# Altium project Telephone.PrjPcb (part 5 of 6)

## Sheet Mechanical.SchDoc: Mechanical
size A4; Organization: ORGANIZATION; Address1: ADDRESS 1; Address2: ADDRESS 2; Address3: ADDRESS 3; Address4: ADDRESS 4; Revision: -; SheetNumber: 11; SheetTotal: 11; ENG_APP_DATE: --/--/--; DSN_APP_DATE: --/--/--; CHK_APP_DATE: --/--/--
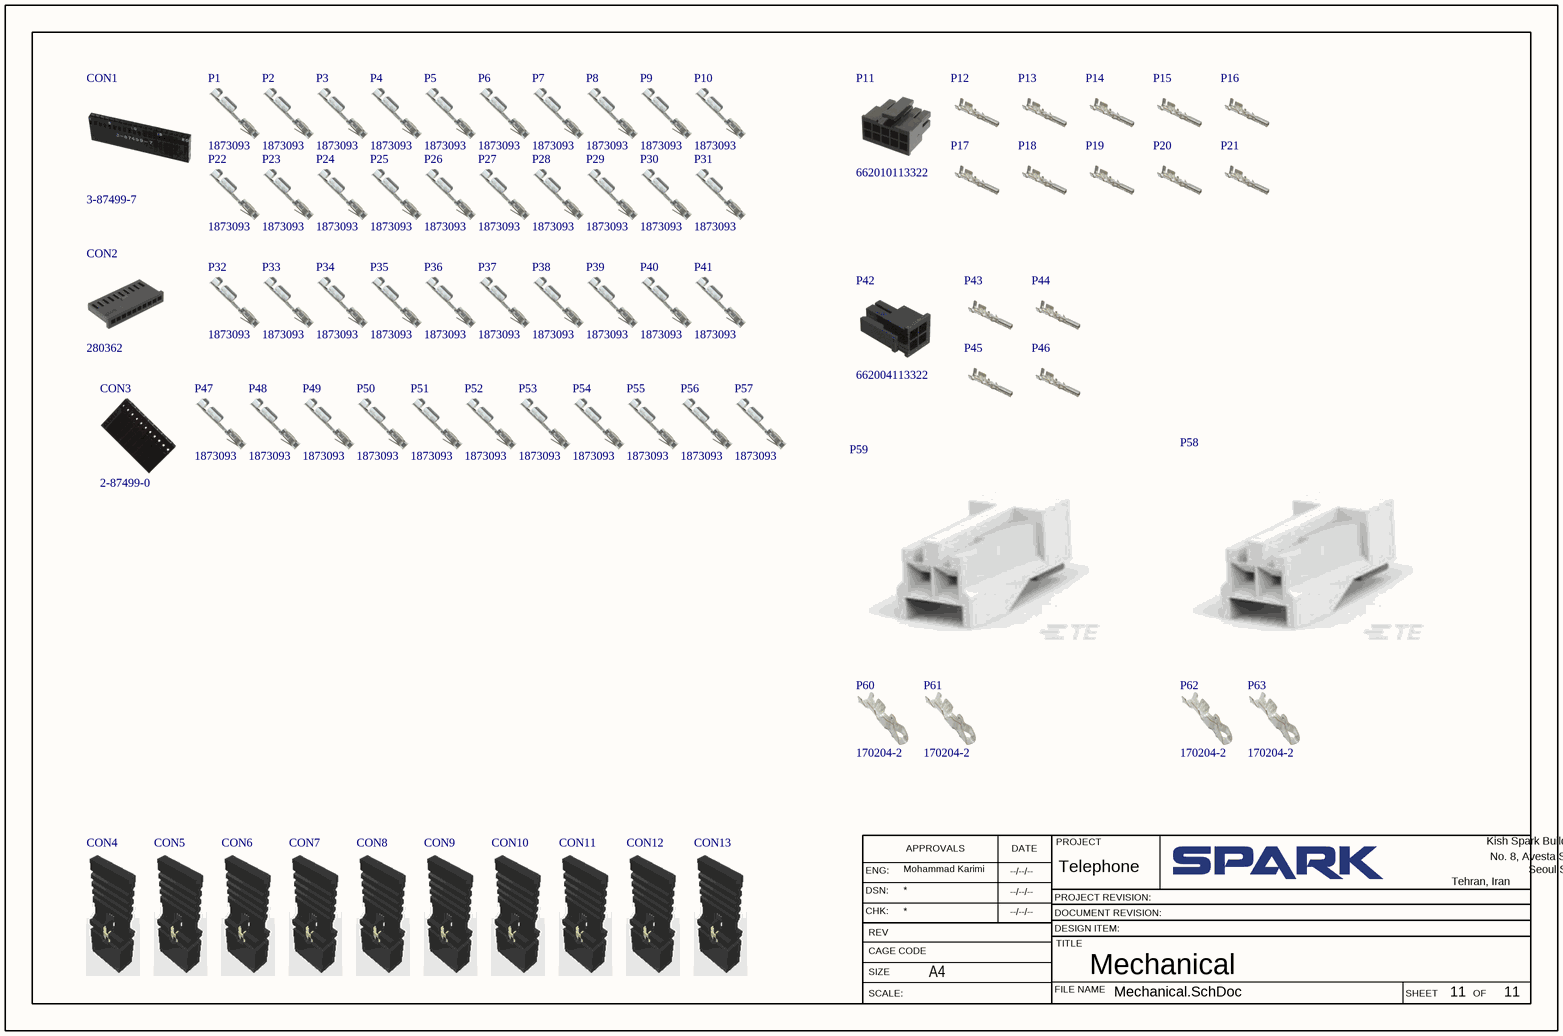
[diagram p9: Mechanical.SchDoc]

### Parts
CON1  3-87499-7  (mechanical)
CON2  280362  (mechanical)
CON3  2-87499-0  (mechanical)
CON4  609002115121  [609002115121-Footprint-1]  (value not drawn)  (mechanical)
CON5  609002115121  [609002115121-Footprint-1]  (value not drawn)  (mechanical)
CON6  609002115121  [609002115121-Footprint-1]  (value not drawn)  (mechanical)
CON7  609002115121  [609002115121-Footprint-1]  (value not drawn)  (mechanical)
CON8  609002115121  [609002115121-Footprint-1]  (value not drawn)  (mechanical)
CON9  609002115121  [609002115121-Footprint-1]  (value not drawn)  (mechanical)
CON10  609002115121  [609002115121-Footprint-1]  (value not drawn)  (mechanical)
CON11  609002115121  [609002115121-Footprint-1]  (value not drawn)  (mechanical)
CON12  609002115121  [609002115121-Footprint-1]  (value not drawn)  (mechanical)
CON13  609002115121  [609002115121-Footprint-1]  (value not drawn)  (mechanical)
P1  1873093  (mechanical)
P2  1873093  (mechanical)
P3  1873093  (mechanical)
P4  1873093  (mechanical)
P5  1873093  (mechanical)
P6  1873093  (mechanical)
P7  1873093  (mechanical)
P8  1873093  (mechanical)
P9  1873093  (mechanical)
P10  1873093  (mechanical)
P11  662010113322  [662010113322-Footprint-1]  (mechanical)
P12  66200113722DEC  (value not drawn)  (mechanical)
P13  66200113722DEC  (value not drawn)  (mechanical)
P14  66200113722DEC  (value not drawn)  (mechanical)
P15  66200113722DEC  (value not drawn)  (mechanical)
P16  66200113722DEC  (value not drawn)  (mechanical)
P17  66200113722DEC  (value not drawn)  (mechanical)
P18  66200113722DEC  (value not drawn)  (mechanical)
P19  66200113722DEC  (value not drawn)  (mechanical)
P20  66200113722DEC  (value not drawn)  (mechanical)
P21  66200113722DEC  (value not drawn)  (mechanical)
P22  1873093  (mechanical)
P23  1873093  (mechanical)
P24  1873093  (mechanical)
P25  1873093  (mechanical)
P26  1873093  (mechanical)
P27  1873093  (mechanical)
P28  1873093  (mechanical)
P29  1873093  (mechanical)
P30  1873093  (mechanical)
P31  1873093  (mechanical)
P32  1873093  (mechanical)
P33  1873093  (mechanical)
P34  1873093  (mechanical)
P35  1873093  (mechanical)
P36  1873093  (mechanical)
P37  1873093  (mechanical)
P38  1873093  (mechanical)
P39  1873093  (mechanical)
P40  1873093  (mechanical)
P41  1873093  (mechanical)
P42  662004113322  [662004113322-Footprint-1]  (mechanical)
P43  66200113722DEC  (value not drawn)  (mechanical)
P44  66200113722DEC  (value not drawn)  (mechanical)
P45  66200113722DEC  (value not drawn)  (mechanical)
P46  66200113722DEC  (value not drawn)  (mechanical)
P47  1873093  (mechanical)
P48  1873093  (mechanical)
P49  1873093  (mechanical)
P50  1873093  (mechanical)
P51  1873093  (mechanical)
P52  1873093  (mechanical)
P53  1873093  (mechanical)
P54  1873093  (mechanical)
P55  1873093  (mechanical)
P56  1873093  (mechanical)
P57  1873093  (mechanical)
P58  CMP-002-00163-4  (value not drawn)  (mechanical)
P59  CMP-002-00163-4  (value not drawn)  (mechanical)
P60  170204-2  (mechanical)
P61  170204-2  (mechanical)
P62  170204-2  (mechanical)
P63  170204-2  (mechanical)

### Notes on the sheet
- APPROVALS
- DATE
- PROJECT
- Kish Spark Building
- No. 8, Avesta Street
- ENG:
- DSN:
- CHK:
- PROJECT REVISION:
- DESIGN ITEM:
- DOCUMENT REVISION:
- Tehran, Iran
- Seoul Street, Sheikh Bahaie
- SIZE
- REV
- SCALE:
- CAGE CODE
- A4
- FILE NAME
- TITLE
- SHEET
- OF

### Library data of the parts
CON1 = CMP-00028-00014-2: Housing, Crimp / Snap, Single Row, 20 250 VAC, 3 A 750 V, AMPMODU Mod IV Series; Approvals: CSA; Connector Type: Receptacle,Socket; Contact Current Rating: 3A; Gender: Receptacle; Insulation Resistance: 5GR; Mating Alignment: No (Without); Max Voltage Rating (AC): 250V; Number of Contacts: 20; Pitch: 2.54mm; Row Spacing: 0.1inch; Max Operating Temperature: 105°C; Min Operating Temperature: -65°C; Mounting Technology: Free Hanging,Cable; Pins: 20; Color: Black; Contact Material: Copper; Contact Type: Male or Female; Current Rating: 3A; Depth: 15.24mm; ELV: Compliant; Flammability Rating: UL94 V-0; Height: 0.14inch; Housing Color: Black; Housing Material: Thermoplastic; Lead Free: Lead Free; Length: 2.01inch; Mating Connector Lock: No (Without); Number of Positions: 20; Number of Rows: 1; Orientation: Straight; Package Quantity: 200; Packaging: Bag; Reach SVHC Compliant: Unknown; Series: AMPMODU MOD IV; Strain Relief: No (Without); Termination: Crimp; Voltage Rating (AC): 250V; Width: 15.24mm
CON2 = CMP-00028-00015-2: Headers & Wire Housings 10 POS RECPT; Manufacturer: TE Connectivity; Pins: 10; Manufacturer Part Number: 280362
CON3 = CMP-00028-00016-2: Conn Housing RCP 11 POS 2.54mm Crimp ST Cable Mount Package; Approvals: CSA; Connector Type: Receptacle,Socket; Contact Current Rating: 3A; Insulation Resistance: 5GR; Mating Alignment: No (Without); Max Voltage Rating (AC): 250V; Number of Contacts: 11; Row Spacing: 0.1inch; Max Operating Temperature: 105°C; Min Operating Temperature: -65°C; Mounting Technology: Free Hanging; Color: Black; Contact Gender: Female; Contact Material: Copper; Contact Type: Female Socket; Current Rating: 3A; Depth: 15.24mm; ELV: Compliant; Flammability Rating: UL94 V-0; Height: 3.56mm; Housing Color: Black; Housing Material: Thermoplastic; Lead Free: Not Applicable; Length: 1.11inch; Mating Connector Lock: No (Without); Number of Positions: 11; Number of Rows: 1; Orientation: Straight; Package Quantity: 1; Packaging: Bulk; Pitch: 2.54mm; Radiation Hardening: No; Series: AMPMODU MOD IV; Strain Relief: No (Without); Termination: Crimp; Voltage Rating (AC): 250V
CON4-CON13 = CMP-00028-00009-4: Insulated WR-PHD Jumper with Testpoint, 3A, 1 x 2, 2.54mm Pitch; Pins: 2
P1-P10 P22-P41 P47-P57 = CMP-00028-00010-3: CONN SOCKET 20-24AWG TIN CRIMP; Approvals: CSA; Contact Current Rating: 3A; Contact Resistance: 12mR; Gender: Female; Insulation Diameter: 1.75mm; Insulation Resistance: 5GR; Shielding: Unshielded; Voltage Rating (AC): 250V; Wire Gauge (Max): 20AWG; Wire Gauge (Min): 24AWG; Wire/Cable Type: Discrete; Max Operating Temperature: 105°C; Min Operating Temperature: -65°C; Mounting Technology: Cable; Connector Type: Socket; Contact Gender: Female; Contact Material: Bronze; Contact Plating: Tin; Contact Type: Signal; Current Rating: 3A; Depth: 2.41mm; ELV: Compliant; Height: 2.03mm; Lead Free: Lead Free; Length: 12.24mm; Orientation: Straight; Package Quantity: 1000; Packaging: Loose Piece; Reach SVHC Compliant: No; Series: AMPMODU Mod V; Termination: Crimp; Wire/Cable Gauge: 24AWG
P11 = CMP-00028-00011-2: WR-MPC3 Series 3mm Pitch 10 Way 2 Row Female Straight PCB Connector Housing 6620; Connector Type: Receptacle; Current Rating: 5A; Insulation: Insulated; Insulation Resistance: 1GR; Number of Contacts: 10; Voltage Rating: 250V; Max Operating Temperature: 105°C; Min Operating Temperature: -25°C; Mounting Technology: Free Hanging; RoHS Compliant: Yes; Color: Black; Contact Gender: Female; Contact Type: Female Socket; Fastening Type: Latch; Flammability Rating: UL94 V-0; Gender: Receptacle; Height: 14mm; Housing Material: Nylon; Length: 15.85mm; Number of Positions: 10; Number of Rows: 2; Packaging: Tray; Pitch: 3mm; Reach SVHC Compliant: Unknown; Series: WR-MPC3; Termination: Crimp; Width: 15.85mm
P12-P21 P43-P46 = CMP-00028-00013-1: WR-MPC3 Series Female Tin Plated CopperAlloy DIN Connector Contact; Contact Design: STAMPED; Current Rating: 5A; Pitch: 3mm; Wire Gauge (Max): 24AWG; Wire Gauge (Min): 20AWG; Pins: 1; Contact Gender: Female; Contact Material: Copper,Tin; Contact Plating: Tin; Height: 2.4mm; Length: 2.6mm; Reach SVHC Compliant: Unknown; Series: WR-MPC3; Termination: Crimp; Width: 15.3mm
P42 = CMP-00028-00012-2: WR-MPC3 Series 3mm Pitch 4 Way 2 Row Female Straight PCB Connector Housing 6620; Connector Type: Receptacle; Current Rating: 5A; Insulation Resistance: 1GR; Number of Contacts: 4; Voltage Rating: 250V; Max Operating Temperature: 105°C; Min Operating Temperature: -25°C; Mounting Technology: Free Hanging; RoHS Compliant: Yes; Color: Black; Contact Type: Female Socket; Fastening Type: Latch; Flammability Rating: UL94 V-0; Gender: Receptacle; Height: 14mm; Housing Material: Nylon; Length: 10.6mm; Number of Positions: 4; Number of Rows: 2; Packaging: Bulk; Pitch: 3mm; Reach SVHC Compliant: Unknown; Row Spacing: 3mm; Series: WR-MPC3; Termination: Crimp; Width: 6.85mm
P58 P59 = CMP-002-00163-4: 2 Position 2.5 mm Crimp Terminal Receptacle Housing Connector; Manufacturer: TE Connectivity; Connector Type: Receptacle,Socket; PCB Mount Retention: Without; Contact Current Rating: 2A; Insulation Resistance: 500MR; Number of Positions: 2; Mating Alignment: Yes (With); Strain Relief: No (Without); Pitch: 2.5mm; Approvals: UL; Manufacturer Part Number: 171822-2; RoHS: Yes; Category: Connectors; Stock 1: 25549; Pricing 1: 1=0.24000, 10=0.16100, 50=0.16100, 100=0.13500, 1000=0.11000, 10000=0.10800 (USD); Mount: Free Hanging,Cable; Housing Color: Natural; Housing Material: Nylon; Color: Natural; Insulation Material: Polyamide; Material: Nylon; Min Operating Temperature: -20°C; Max Operating Temperature: 95°C; Series: EI; Packaging: Bag; Termination: Crimp; Orientation: Straight; Contact Type: Female Socket; Number of Rows: 1; Gender: Receptacle; Contact Gender: Female; Number of Contacts: 2; Mating Retention: Yes (With); Mating Connector Lock: Yes (With); Length: 14mm; Width: 14mm; Height: 5.75mm; Depth: 14mm; RoHS Compliant: Yes; ELV: Compliant; Lead Free: Lead Free; Flammability Rating: UL94 V-0; Reach SVHC Compliant: Yes; ComponentLink1URL: https://datasheet.ciiva.com/5795/1504042-5795504.pdf?src-supplier=Farnell; ComponentLink1Description: https://datasheet.ciiva.com/5795/1504042-5795504.pdf?src-supplier=Farnell; ComponentLink2URL: https://datasheet.ciiva.com/15178/getdatasheetpartid-138116-15178665.pdf?src-supplier=Verical; ComponentLink2Description: https://datasheet.ciiva.com/15178/getdatasheetpartid-138116-15178665.pdf?src-supplier=Verical; ComponentLink3URL: https://datasheet.ciiva.com/16321/tyco20171822-2-16321341.pdf?src-supplier=Future+Electronics; ComponentLink3Description: https://datasheet.ciiva.com/16321/tyco20171822-2-16321341.pdf?src-supplier=Future+Electronics; ComponentLink4URL: https://datasheet.ciiva.com/23813/573455-23813958.pdf?src-supplier=Newark; ComponentLink4Description: https://datasheet.ciiva.com/23813/573455-23813958.pdf?src-supplier=Newark; ComponentLink5URL: https://datasheet.ciiva.com/11740/0900766b80d9a1b1-11740548.pdf?src-supplier=Rs; ComponentLink5Description: https://datasheet.ciiva.com/11740/0900766b80d9a1b1-11740548.pdf?src-supplier=Rs; ComponentLink6URL: https://datasheet.ciiva.com/762/eng-cd-171822-l2-762908.pdf?src-supplier=Digi-Key; ComponentLink6Description: https://datasheet.ciiva.com/762/eng-cd-171822-l2-762908.pdf?src-supplier=Digi-Key; ComponentLink7URL: https://datasheet.ciiva.com/30108/pgurl-0-171822-2-0-30108319.pdf?src-supplier=Onlinecomponents.com; ComponentLink7Description: https://datasheet.ciiva.com/30108/pgurl-0-171822-2-0-30108319.pdf?src-supplier=Onlinecomponents.com; Case/Package: 1000; Pins: 0; Design Item ID: 171822-2; Component Type: Mechanical; Current Rating: 2A; Source: PTZ.SCHLIB
P60-P63 = CMP-002-00176-3: 170204-2 TE Connectivity Connector Contacts SKT Crimp ST Cable Mount 20-26AWG Loose - Arrow.com; Connector Type: Socket; Gender: Female; Insulation Resistance: 500MR; PCB Mount Retention: Without; Contact Current Rating: 2A; Number of Contacts: 6; Shielding: Unshielded; Voltage Rating (AC): 600V; Wire/Cable Gauge: 26AWG; Wire Gauge (Min): 20AWG; Pitch: 2.54mm; Insulation Diameter: 1.91mm; Plating Thickness: 0.8um; Voltage Rating: 250V; Manufacturer: TE Connectivity; Manufacturer Part Number: 170204-2; RoHS: Yes; Category: Connectors; Stock 1: 90196; Pricing 1: 1=0.12, 10=0.088, 50=0.088, 100=0.074, 1000=0.065, 10000=0.065 (USD); Mount: Cable,Through Hole; Contact Material: Bronze; Contact Plating: Tin; Housing Color: White; Housing Material: Nylon; Min Operating Temperature: -20°C; Max Operating Temperature: 105°C; Series: EI; Packaging: Loose Piece; Termination: Crimp; Contact Gender: Female; Orientation: Straight; Contact Type: Signal; Number of Rows: 1; Length: 11.1mm; Height: 10.79mm; Wire Gauge (Max): 26AWG; Depth: 2.36mm; RoHS Compliant: Yes; Reach SVHC Compliant: No; Lead Free: Lead Free; ELV: Compliant; ComponentLink1URL: https://datasheet.ciiva.com/16313/170204-2-16313345.pdf?src-supplier=Future+Electronics; ComponentLink1Description: https://datasheet.ciiva.com/16313/170204-2-16313345.pdf?src-supplier=Future+Electronics; ComponentLink2URL: https://datasheet.ciiva.com/19462/1962957-19462033.pdf?src-supplier=Jameco; ComponentLink2Description: https://datasheet.ciiva.com/19462/1962957-19462033.pdf?src-supplier=Jameco; ComponentLink3URL: https://datasheet.ciiva.com/22685/1688153-22685777.pdf?src-supplier=Element14; ComponentLink3Description: https://datasheet.ciiva.com/22685/1688153-22685777.pdf?src-supplier=Element14; ComponentLink4URL: https://datasheet.ciiva.com/18487/jpn-ss-114-5035-h-18487847.pdf?src-supplier=Digi-Key; ComponentLink4Description: https://datasheet.ciiva.com/18487/jpn-ss-114-5035-h-18487847.pdf?src-supplier=Digi-Key; ComponentLink5URL: https://datasheet.ciiva.com/15175/getdatasheetpartid-32247-15175269.pdf?src-supplier=Verical; ComponentLink5Description: https://datasheet.ciiva.com/15175/getdatasheetpartid-32247-15175269.pdf?src-supplier=Verical; ComponentLink6URL: https://datasheet.ciiva.com/11723/0900766b80d9a1b2-11723424.pdf?src-supplier=Rs; ComponentLink6Description: https://datasheet.ciiva.com/11723/0900766b80d9a1b2-11723424.pdf?src-supplier=Rs; ComponentLink7URL: https://datasheet.ciiva.com/30100/basics0-171822-2-0-30100471.pdf?src-supplier=Onlinecomponents.com; ComponentLink7Description: https://datasheet.ciiva.com/30100/basics0-171822-2-0-30100471.pdf?src-supplier=Onlinecomponents.com; ComponentLink8URL: https://datasheet.ciiva.com/16934/70085978-16934021.pdf?src-supplier=Allied+Electronics; ComponentLink8Description: https://datasheet.ciiva.com/16934/70085978-16934021.pdf?src-supplier=Allied+Electronics; ComponentLink9URL: https://datasheet.ciiva.com/696/jpn-ss-114-5035-h-696652.pdf?src-supplier=Digi-Key; ComponentLink9Description: https://datasheet.ciiva.com/696/jpn-ss-114-5035-h-696652.pdf?src-supplier=Digi-Key; Case/Package: 1000; Pins: 0; Design Item ID: 170204-2; Component Type: Mechanical; Source: V4-TEL.SCHLIB; Mounting Technology: Cable,Through Hole; Max Voltage Rating (AC): 250V; Package Quantity: 1000

## Sheet EEPROM.SchDoc: EEPROM
size A4; Organization: ORGANIZATION; Address1: ADDRESS 1; Address2: ADDRESS 2; Address3: ADDRESS 3; Address4: ADDRESS 4; Revision: -; SheetNumber: 4; SheetTotal: 11; ENG_APP_DATE: --/--/--; DSN_APP_DATE: --/--/--; CHK_APP_DATE: --/--/--
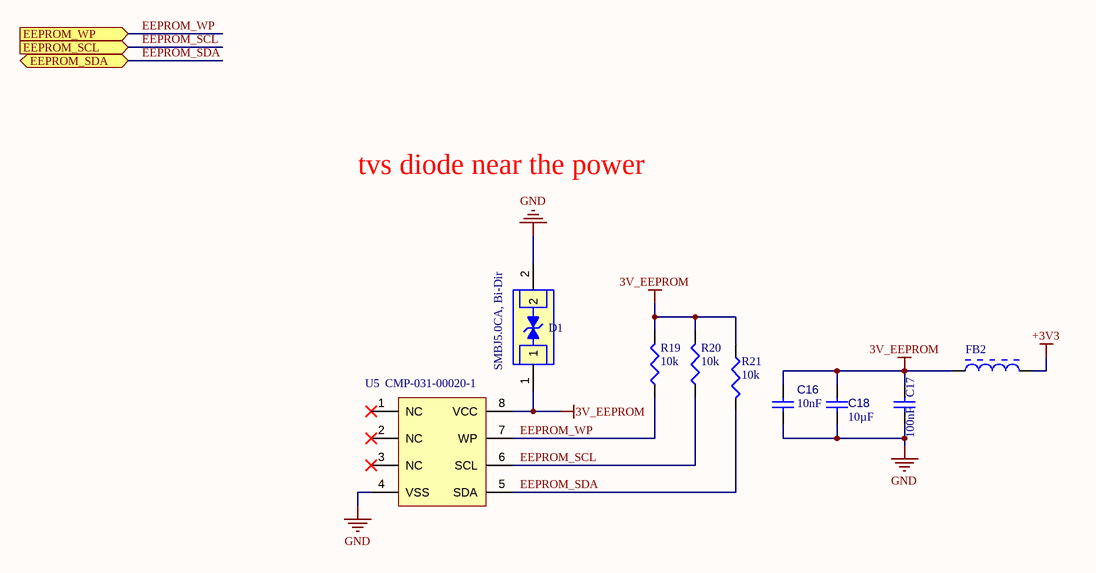
[diagram p10: EEPROM.SchDoc]

### Parts
C16  value 10nF  [C0603]  (hidden comment: 06035C103KAT2A)
C17  value 100nF  [C0603]  (hidden comment: CC0603KRX7R8BB104)
C18  value 10µF  [0805]  (hidden comment: C0805C106K9PACTU)
D1  value SMBJ5.0CA, Bi-Dir  [SMB (DO-214AA)]  (hidden comment: CMP-004-00053-1)
FB2  CMP-006-00051-1  [R0603]  (value not drawn)
R19  value 10k  [R0603]  (hidden comment: CRCW060310K0JNEA)
R20  value 10k  [R0603]  (hidden comment: CRCW060310K0JNEA)
R21  value 10k  [R0603]  (hidden comment: CRCW060310K0JNEA)
U5  CMP-031-00020-1  [NV24C16UV]

### Ports
EEPROM_SCL (in), EEPROM_SDA (bidir), EEPROM_WP (in)

### Nets
3V_EEPROM: C16.2 C17.1 C18.2 D1.1 FB2.1 R19.2 R20.2 R21.1 U5.8(VCC)
+3V3: FB2.2
GND: C16.1 C17.2 C18.1 D1.2 U5.4(VSS)
EEPROM_SCL: R20.1 U5.6(SCL) ; port EEPROM_SCL
EEPROM_SDA: R21.2 U5.5(SDA) ; port EEPROM_SDA
EEPROM_WP: R19.1 U5.7(WP) ; port EEPROM_WP

Not connected (* = marked no-connect by the designer): U5 1(NC)* 2(NC)* 3(NC)*

### Notes on the sheet
- tvs diode near the power
- APPROVALS
- DATE
- PROJECT
- Kish Spark Building
- No. 8, Avesta Street
- ENG:
- DSN:
- CHK:
- PROJECT REVISION:
- DESIGN ITEM:
- DOCUMENT REVISION:
- Tehran, Iran
- Seoul Street, Sheikh Bahaie
- SIZE
- REV
- SCALE:
- CAGE CODE
- A4
- FILE NAME
- TITLE
- SHEET
- OF

### Library data of the parts
C16 = CMP-001-00096-2: 0603 10nF 50 V ±10 % Tolerance X7R Surface Mount Multilayer Ceramic Capacitor; Manufacturer: Kyocera AVX; Voltage Rating: 50V; Tolerance: 10%; Dissipation Factor: 2.5%; Insulation Resistance: 100GR; Case/Package: 0603; Pins: 2; Min Operating Temperature: -55°C; Max Operating Temperature: 125°C; Design Item ID: 06035C103KAT2A; Case Code (Metric): 1608; Category: Ceramic Capacitors; Contact Plating: Tin,Matte; Depth: 0.81mm; Dielectric: X7R; Dielectric Material: Ceramic; Height: 0.9mm; Lead Free: Lead Free; Length: 1.6mm; Manufacturer Part Number: 06035C103KAT2A; Mount: Surface Mount,PCB; Packaging: Tape and Reel; Radiation Hardening: No; REACH SVHC: No SVHC; RoHS: Yes; Stock 1: 4334081; Termination: SMD/SMT; Thickness: 0.035inch; Voltage: 50V; Voltage Rating (DC): 50V; Width: 0.032inch; ComponentLink1Description: https://datasheet.ciiva.com/2987/cx7r-2987824.pdf?src-supplier=Avnet; ComponentLink1URL: https://datasheet.ciiva.com/2987/cx7r-2987824.pdf?src-supplier=Avnet; ComponentLink2Description: https://datasheet.ciiva.com/1124/1679506-1124848.pdf?src-supplier=Element14; ComponentLink2URL: https://datasheet.ciiva.com/1124/1679506-1124848.pdf?src-supplier=Element14; ComponentLink3Description: https://datasheet.ciiva.com/7855/1679506-7855082.pdf?src-supplier=Element14; ComponentLink3URL: https://datasheet.ciiva.com/7855/1679506-7855082.pdf?src-supplier=Element14; ComponentLink4Description: https://datasheet.ciiva.com/150/cx7r-150227.pdf?src-supplier=Digi-Key; ComponentLink4URL: https://datasheet.ciiva.com/150/cx7r-150227.pdf?src-supplier=Digi-Key; ComponentLink5Description: https://datasheet.ciiva.com/150/cx7r-150229.pdf?src-supplier=Digi-Key; ComponentLink5URL: https://datasheet.ciiva.com/150/cx7r-150229.pdf?src-supplier=Digi-Key
C17 = CMP-001-00108-2: YAGEO - CC0603KRX7R8BB104 - CERAMIC CAPACITOR, 0.1UF, 25V, X7R, 10%, 0603, FULL REEL; Case/Package: 0603; Pins: 2; RoHS Compliant: Yes; Min Operating Temperature: -55°C; Max Operating Temperature: 125°C; Voltage Rating: 25V; Tolerance: 10%; Design Item ID: CC0603KRX7R8BB104; Case Code (Metric): 1608; Category: Ceramic Capacitors; Depth: 0.8mm; Dielectric: X7R; Halogen Free: Halogen Free; Height: 0.8mm; Lead Free: Lead Free; Length: 1.6mm; Manufacturer 1: Yageo; Manufacturer Part Number 1: CC0603KRX7R8BB104; Mount: Surface Mount; Package Quantity: 1; Packaging: Tape and Reel; Pricing 1: 1=0.10000, 10=0.05000, 50=0.02720, 100=0.02220, 500=0.01586, 1000=0.01246 (USD); Radiation Hardening: No; REACH SVHC: Unknown; Resistor Type: Ceramic; RoHS: Yes; Series: CC; Source: PTZLib.SchLib; Stock 1: 4053185; Termination: SMD/SMT; Thickness: 0.035inch; Voltage: 25V; Voltage Rating (DC): 25V; Width: 0.8mm; ComponentLink1Description: https://datasheet.ciiva.com/144/mlccorderingcode-144075.pdf?src-supplier=Digi-Key; ComponentLink1URL: https://datasheet.ciiva.com/144/mlccorderingcode-144075.pdf?src-supplier=Digi-Key; ComponentLink2Description: https://datasheet.ciiva.com/11786/0900766b80c10176-11786120.pdf?src-supplier=RSComponents; ComponentLink2URL: https://datasheet.ciiva.com/11786/0900766b80c10176-11786120.pdf?src-supplier=RSComponents; ComponentLink3Description: https://datasheet.ciiva.com/7978/1489800-7978155.pdf?src-supplier=Element14; ComponentLink3URL: https://datasheet.ciiva.com/7978/1489800-7978155.pdf?src-supplier=Element14; ComponentLink4Description: https://datasheet.ciiva.com/28450/1489800-28450584.pdf?src-supplier=Element14; ComponentLink4URL: https://datasheet.ciiva.com/28450/1489800-28450584.pdf?src-supplier=Element14; ComponentLink5Description: https://datasheet.ciiva.com/144/mlccorderingcode-144074.pdf?src-supplier=Digi-Key; ComponentLink5URL: https://datasheet.ciiva.com/144/mlccorderingcode-144074.pdf?src-supplier=Digi-Key; ComponentLink6Description: https://datasheet.ciiva.com/144/mlccorderingcode-144073.pdf?src-supplier=Digi-Key; ComponentLink6URL: https://datasheet.ciiva.com/144/mlccorderingcode-144073.pdf?src-supplier=Digi-Key; ComponentLink7Description: https://datasheet.ciiva.com/13389/upy-gphc-x7r-6-3v-to-50v-8-13389352.pdf?src-supplier=Mouser; ComponentLink7URL: https://datasheet.ciiva.com/13389/upy-gphc-x7r-6-3v-to-50v-8-13389352.pdf?src-supplier=Mouser; ComponentLink8Description: https://datasheet.ciiva.com/11587/upy-gphc-x7r-6-3v-to-50v-8-11587208.pdf?src-supplier=Avnet; ComponentLink8URL: https://datasheet.ciiva.com/11587/upy-gphc-x7r-6-3v-to-50v-8-11587208.pdf?src-supplier=Avnet; ComponentLink9Description: https://datasheet.ciiva.com/26829/getdatasheetpartid-403577-26829431.pdf?src-supplier=Verical; ComponentLink9URL: https://datasheet.ciiva.com/26829/getdatasheetpartid-403577-26829431.pdf?src-supplier=Verical; ComponentLink10Description: https://datasheet.ciiva.com/17434/upy-gphc-x7r-6-3v-to-50v-8-17434263.pdf?src-supplier=Avnet+Europe; ComponentLink10URL: https://datasheet.ciiva.com/17434/upy-gphc-x7r-6-3v-to-50v-8-17434263.pdf?src-supplier=Avnet+Europe
C18 = CMP-001-00180-2: Ceramic Capacitor, 10UF, 6.3V, X5R, 10%, 0805, Full Reel; Manufacturer: KEMET; Dissipation Factor: 5%; Capacitor Type: Ceramic Capacitors; Manufacturer Part Number: C0805C106K9PACTU; Mount: Surface Mount; Case/Package: 0805; Case Code (Metric): 2012; Dielectric Material: Ceramic; Contact Material: Tin; Min Operating Temperature: -55°C; Max Operating Temperature: 85°C; Tolerance: 10%; Voltage Rating (DC): 6.3V; Dielectric: X5R; Packaging: Tape and Reel; Voltage Rating: 6.3V; Series: SMD Comm X5R; Construction: Flat; Length: 2mm; Width: 1.2mm; Height: 1.25mm; Depth: 1.25mm; Lead Pitch: 0.75mm; Radiation Hardening: No; RoHS Compliant: Yes; Lead Free: Lead Free; Reach SVHC Compliant: No; ComponentLink1URL: https://datasheet.ciiva.com/7842/kem-c1006-x5r-smd-7842200.pdf?src-supplier=Element14; ComponentLink1Description: https://datasheet.ciiva.com/7842/kem-c1006-x5r-smd-7842200.pdf?src-supplier=Element14; ComponentLink2URL: https://datasheet.ciiva.com/7842/kem-c1006-x5r-smd-7842201.pdf?src-supplier=Element14; ComponentLink2Description: https://datasheet.ciiva.com/7842/kem-c1006-x5r-smd-7842201.pdf?src-supplier=Element14; ComponentLink3URL: https://datasheet.ciiva.com/7842/40889-7842553.pdf?src-supplier=Element14; ComponentLink3Description: https://datasheet.ciiva.com/7842/40889-7842553.pdf?src-supplier=Element14; ComponentLink4URL: https://datasheet.ciiva.com/7842/40889-7842554.pdf?src-supplier=Element14; ComponentLink4Description: https://datasheet.ciiva.com/7842/40889-7842554.pdf?src-supplier=Element14; ComponentLink5URL: https://datasheet.ciiva.com/18193/getdatasheetpartid-320652-18193500.pdf?src-supplier=Verical; ComponentLink5Description: https://datasheet.ciiva.com/18193/getdatasheetpartid-320652-18193500.pdf?src-supplier=Verical; Pins: 2; Mounting Technology: SMD/SMT
D1 = CMP-004-00053-1: Diode TVS Single Bi-Dir 5V 600W 2-Pin SMBJ; Manufacturer: Bourns; Min Breakdown Voltage: 6.4V; Max Surge Current: 100A; Breakdown Voltage: 7.25V; Polarity: Bidirectional; Peak Pulse Current: 65.2A; Number of Bidirectional Channels: 1; Power Line Protection: No; Diode Type: ZENER; Operating Supply Voltage: 3.5V; Max Reverse Leakage Current: 1.6mA; Test Current: 10mA; Clamping Voltage: 9.2V; Manufacturer Part Number: SMBJ5.0CA; RoHS: Yes; Category: TVS Diodes; Case/Package: DO-214AA; Pins: 2; Min Operating Temperature: -55°C; Max Operating Temperature: 150°C; Packaging: Tape and Reel; Reverse Standoff Voltage: 5V; Peak Pulse Power: 600W; Package Quantity: 1; Termination: SMD/SMT; Max Power Dissipation: 600W; Series: SMBJ; Direction: Bidirectional; Number of Channels: 1; Max Breakdown Voltage: 7.25V; Radiation Hardening: No; RoHS Compliant: Yes; ComponentLink1URL: https://datasheet.ciiva.com/334/smbj-334706.pdf?src-supplier=Digi-Key; ComponentLink1Description: https://datasheet.ciiva.com/334/smbj-334706.pdf?src-supplier=Digi-Key; ComponentLink2URL: https://datasheet.ciiva.com/3022/smbj-3022578.pdf?src-supplier=Avnet; ComponentLink2Description: https://datasheet.ciiva.com/3022/smbj-3022578.pdf?src-supplier=Avnet; ComponentLink3URL: https://datasheet.ciiva.com/334/smbj-334707.pdf?src-supplier=Digi-Key; ComponentLink3Description: https://datasheet.ciiva.com/334/smbj-334707.pdf?src-supplier=Digi-Key; ComponentLink4URL: https://datasheet.ciiva.com/334/smbj-334708.pdf?src-supplier=Digi-Key; ComponentLink4Description: https://datasheet.ciiva.com/334/smbj-334708.pdf?src-supplier=Digi-Key; ComponentLink5URL: https://datasheet.ciiva.com/28410/1677318-28410120.pdf?src-supplier=Element14; ComponentLink5Description: https://datasheet.ciiva.com/28410/1677318-28410120.pdf?src-supplier=Element14; ComponentLink6URL: https://datasheet.ciiva.com/8031/1677318-8031161.pdf?src-supplier=Element14; ComponentLink6Description: https://datasheet.ciiva.com/8031/1677318-8031161.pdf?src-supplier=Element14; ComponentLink7URL: https://datasheet.ciiva.com/30104/smbj-30104446.pdf?src-supplier=Onlinecomponents.com; ComponentLink7Description: https://datasheet.ciiva.com/30104/smbj-30104446.pdf?src-supplier=Onlinecomponents.com; Design Item ID: SMBJ5.0CA; Component Type: Standard; Element Configuration: Single; Leakage Current: 1.6mA; Mount: Surface Mount; Number of Elements: 1; Pin Count: 2; Pricing 1: 1=0.51000, 10=0.38300, 50=0.38300, 100=0.23900, 1000=0.13000, 10000=0.12600 (USD); REACH SVHC: No SVHC; Resistor Type: Zener; Reverse Breakdown Voltage: 6.4V; Source: PTZ.SCHLIB; Stock 1: 248
FB2 = CMP-006-00051-1: Ferrite Beads 0603 60ohm; Manufacturer 1: Murata; Manufacturer Part Number 1: BLM18PG471SN1B; Tolerance: 25%; Impedance: 470R; DC Resistance (DCR): 200mR; Current Rating: 1A; RoHS: Yes; Category: Ferrite Beads and Chips; Case/Package: 0603; Min Operating Temperature: -55°C; Max Operating Temperature: 125°C; Package Quantity: 1000; Packaging: Bulk; ComponentLink1URL: http://www.mouser.com/ds/2/281/c31e-794748.pdf?src-supplier=Mouser; ComponentLink1Description: http://www.mouser.com/ds/2/281/c31e-794748.pdf?src-supplier=Mouser; Pins: 2; Design Item ID: BLM18PG471SN1B; Source: PTZLib.SchLib
R19-R21 = CMP-009-00213-1: Res Thick Film 0603 10K Ohm 5% 1/10W 200ppm/C Molded SMD SMD Paper T/R; Manufacturer 1: Vishay Dale; Voltage Rating: 75V; Max Power Dissipation: 100mW; Temperature Coefficient: 200ppm/°C; Case/Package: 0603; Pins: 2; RoHS Compliant: Yes; Min Operating Temperature: -55°C; Max Operating Temperature: 155°C; Tolerance: 5%; Design Item ID: CRCW060310K0JNEA; Case Code (Metric): 1608; Category: Chip SMD Resistors; Construction: Rectangular; Contact Plating: Tin; Depth: 0.85mm; Features: Automotive AEC-Q200; Height: 0.02inch; Lead Free: Lead Free; Length: 1.55mm; Manufacturer Part Number 1: CRCW060310K0JNEA; Military Standard: Not; Mount: Surface Mount; Number of Terminations: 2; Package Quantity: 1; Packaging: Tape and Reel; Power Rating: 100mW; Pricing 1: 1=0.10000, 10=0.03300, 100=0.01360, 1000=0.00610, 2500=0.00529 (USD); Radiation Hardening: No; REACH SVHC: Unknown; Resistance Tolerance: 5%; Resistor Type: Thick Film; RoHS: Yes; Series: CRCW; Size Code: 0603; Source: PTZLib.SchLib; Stock 1: 41; Termination: SMD/SMT; Voltage Rating (DC): 75V; Weight: 7.1E-05oz; Width: 0.033inch; ComponentLink1Description: https://datasheet.ciiva.com/3256/dcrcwe3-3256943.pdf?src-supplier=Avnet; ComponentLink1URL: https://datasheet.ciiva.com/3256/dcrcwe3-3256943.pdf?src-supplier=Avnet; ComponentLink2Description: https://datasheet.ciiva.com/2461/dcrcwe3-2461971.pdf?src-supplier=Digi-Key; ComponentLink2URL: https://datasheet.ciiva.com/2461/dcrcwe3-2461971.pdf?src-supplier=Digi-Key; ComponentLink3Description: https://datasheet.ciiva.com/2461/dcrcwe3-2461972.pdf?src-supplier=Digi-Key; ComponentLink3URL: https://datasheet.ciiva.com/2461/dcrcwe3-2461972.pdf?src-supplier=Digi-Key; ComponentLink4Description: https://datasheet.ciiva.com/2461/dcrcwe3-2461973.pdf?src-supplier=Digi-Key; ComponentLink4URL: https://datasheet.ciiva.com/2461/dcrcwe3-2461973.pdf?src-supplier=Digi-Key; ComponentLink5Description: https://datasheet.ciiva.com/3256/dcrcwe3-3256942.pdf?src-supplier=Avnet; ComponentLink5URL: https://datasheet.ciiva.com/3256/dcrcwe3-3256942.pdf?src-supplier=Avnet; ComponentLink6Description: https://datasheet.ciiva.com/16343/dcrcwe3-16343525.pdf?src-supplier=Future+Electronics; ComponentLink6URL: https://datasheet.ciiva.com/16343/dcrcwe3-16343525.pdf?src-supplier=Future+Electronics; ComponentLink7Description: https://datasheet.ciiva.com/16755/70201119-16755717.pdf?src-supplier=Allied+Electronics; ComponentLink7URL: https://datasheet.ciiva.com/16755/70201119-16755717.pdf?src-supplier=Allied+Electronics; ComponentLink8Description: https://datasheet.ciiva.com/16515/dcrcwe3-16515020.pdf?src-supplier=Avnet+Asia; ComponentLink8URL: https://datasheet.ciiva.com/16515/dcrcwe3-16515020.pdf?src-supplier=Avnet+Asia; ComponentLink9Description: https://datasheet.ciiva.com/16771/70201119-16771051.pdf?src-supplier=Allied+Electronics; ComponentLink9URL: https://datasheet.ciiva.com/16771/70201119-16771051.pdf?src-supplier=Allied+Electronics
U5 = CMP-031-00020-1: EEPROM Serial 16-Kb I2C - Automotive Grade; Manufacturer: ON Semiconductor; Manufacturer Part Number: NV24C16MUW3VLTBG; RoHS: No; Category: EEPROM; Pricing 1: 1=0.39, 10=0.374, 50=0.374, 100=0.307, 1000=0.291, 10000=0.276 (USD); Design Item ID: NV24C16MUW3VLTBG; Component Type: Standard; Pin Count: 8; Source: V4-TEL.SCHLIB

## Sheet CallerID.SchDoc: Caller ID
size A4; Organization: ORGANIZATION; Address1: ADDRESS 1; Address2: ADDRESS 2; Address3: ADDRESS 3; Address4: ADDRESS 4; Revision: -; SheetNumber: 7; SheetTotal: 11; ENG_APP_DATE: --/--/--; DSN_APP_DATE: --/--/--; CHK_APP_DATE: --/--/--
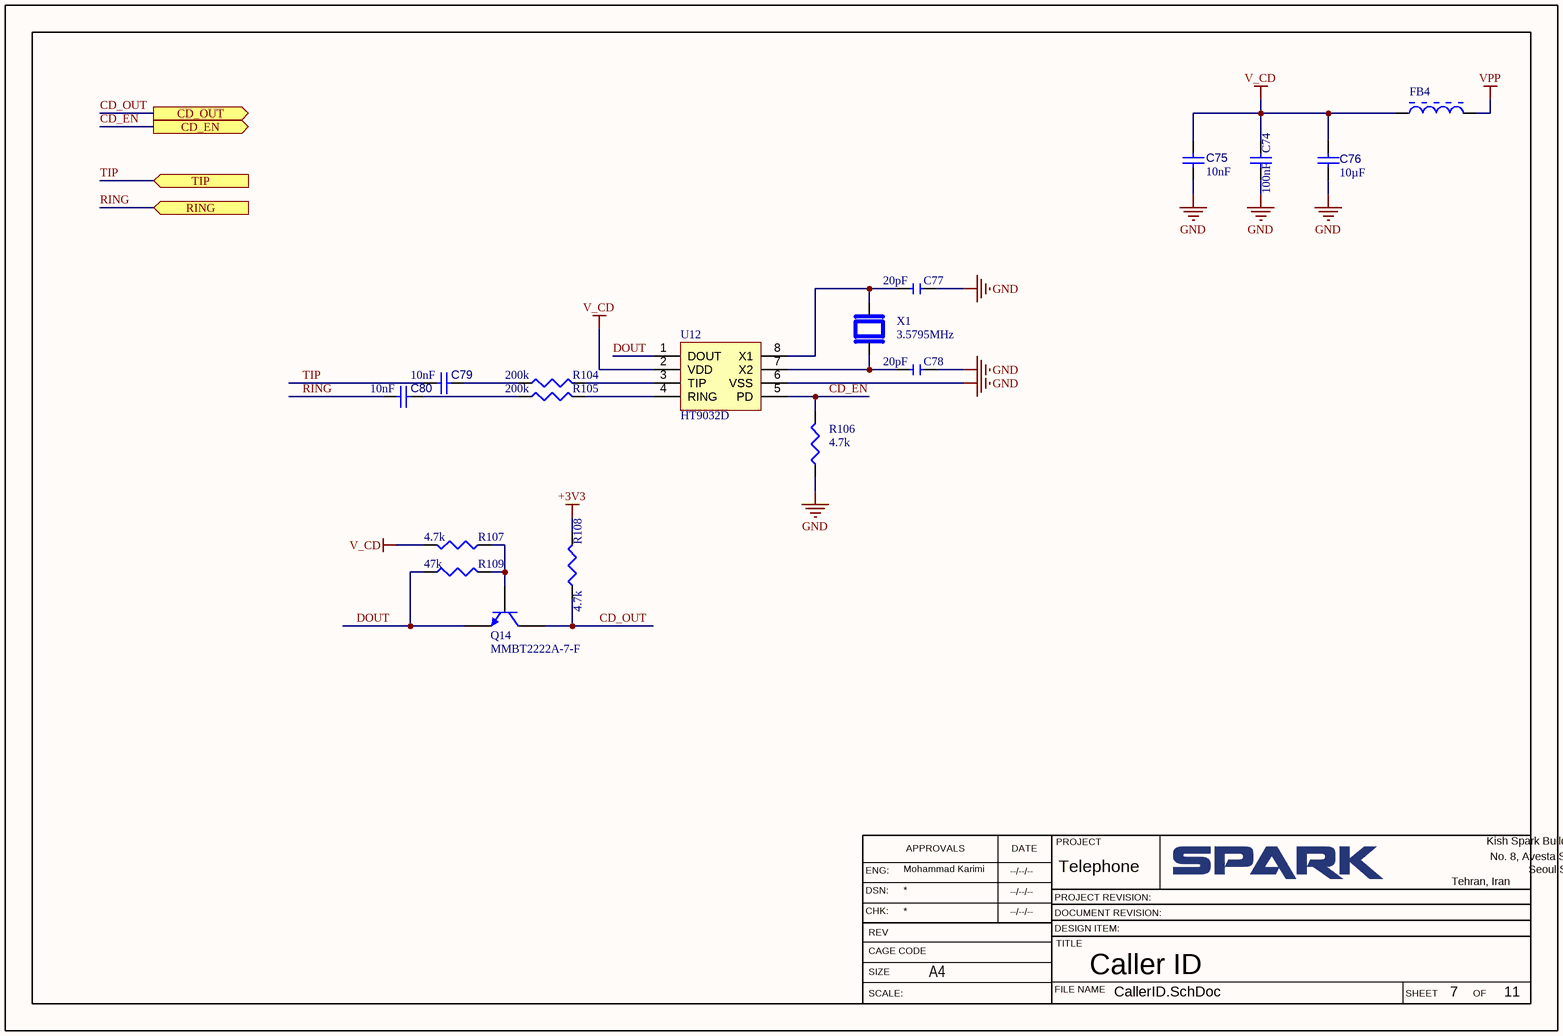
[diagram p11: CallerID.SchDoc]

### Parts
C74  value 100nF  [C0603]  (hidden comment: CC0603KRX7R8BB104)
C75  value 10nF  [C0603]  (hidden comment: 06035C103KAT2A)
C76  value 10µF  [0805]  (hidden comment: C0805C106K9PACTU)
C77  value 20pF  [0805]  (hidden comment: CMP-001-00183-1)
C78  value 20pF  [0805]  (hidden comment: CMP-001-00183-1)
C79  value 10nF  [C0603]  (hidden comment: 06035C103KAT2A)
C80  value 10nF  [C0603]  (hidden comment: 06035C103KAT2A)
FB4  CMP-006-00051-1  [R0603]  (value not drawn)
Q14  MMBT2222A-7-F  [SOT23127P600-8N]
R104  value 200k  [0805]  (hidden comment: CMP-009-00307-1)
R105  value 200k  [0805]  (hidden comment: CMP-009-00307-1)
R106  value 4.7k  [R0603]  (hidden comment: KTR03EZPJ472)
R107  value 4.7k  [R0603]  (hidden comment: KTR03EZPJ472)
R108  value 4.7k  [R0603]  (hidden comment: KTR03EZPJ472)
R109  value 47k  [0805]  (hidden comment: CMP-009-00314-1)
U12  HT9032D  [SSOIC8]
X1  Frequency: 3.5795MHz  [XTAL]  (hidden comment: CMP-003-00038-1)

### Ports
CD_EN (out), CD_OUT (out), RING (in), TIP (in)

### Nets
+3V3: R108.2
GND: C74.2 C75.2 C76.1 C77.1 C78.1 R106.1 U12.6(VSS)
V_CD: C74.1 C75.1 C76.2 FB4.1 R107.2 U12.2(VDD)
VPP: FB4.2
CD_EN: R106.2 U12.5(PD) ; port CD_EN
CD_OUT: Q14.3(C) R108.1 ; port CD_OUT
DOUT: Q14.1(E) R109.1 U12.1(DOUT)
RING: C80.2 ; port RING
TIP: C79.2 ; port TIP
NetC77_2: C77.2 U12.8(X1) X1.1
NetC78_2: C78.2 U12.7(X2) X1.2
NetC79_1: C79.1 R104.1
NetC80_1: C80.1 R105.1
NetQ14_2: Q14.2(B) R107.1 R109.2
NetR104_2: R104.2 U12.3(TIP)
NetR105_2: R105.2 U12.4(RING)

### Notes on the sheet
- APPROVALS
- DATE
- PROJECT
- Kish Spark Building
- No. 8, Avesta Street
- ENG:
- DSN:
- CHK:
- PROJECT REVISION:
- DESIGN ITEM:
- DOCUMENT REVISION:
- Tehran, Iran
- Seoul Street, Sheikh Bahaie
- SIZE
- REV
- SCALE:
- CAGE CODE
- A4
- FILE NAME
- TITLE
- SHEET
- OF

### Library data of the parts
C74 = CMP-001-00108-2: as C17 on sheet EEPROM; Case/Package: 0603; Pins: 2; RoHS Compliant: Yes; Min Operating Temperature: -55°C; Max Operating Temperature: 125°C; Voltage Rating: 25V; Tolerance: 10%; Design Item ID: CC0603KRX7R8BB104; Case Code (Metric): 1608; Category: Ceramic Capacitors; Depth: 0.8mm; Dielectric: X7R; Halogen Free: Halogen Free; Height: 0.8mm; Lead Free: Lead Free; Length: 1.6mm; Manufacturer 1: Yageo; Manufacturer Part Number 1: CC0603KRX7R8BB104; Mount: Surface Mount; Package Quantity: 1; Packaging: Tape and Reel; Pricing 1: 1=0.10000, 10=0.05000, 50=0.02720, 100=0.02220, 500=0.01586, 1000=0.01246 (USD); Radiation Hardening: No; REACH SVHC: Unknown; Resistor Type: Ceramic; RoHS: Yes; Series: CC; Source: PTZLib.SchLib; Stock 1: 4053185; Termination: SMD/SMT; Thickness: 0.035inch; Voltage: 25V; Voltage Rating (DC): 25V; Width: 0.8mm; ComponentLink1Description: https://datasheet.ciiva.com/144/mlccorderingcode-144075.pdf?src-supplier=Digi-Key; ComponentLink1URL: https://datasheet.ciiva.com/144/mlccorderingcode-144075.pdf?src-supplier=Digi-Key; ComponentLink2Description: https://datasheet.ciiva.com/11786/0900766b80c10176-11786120.pdf?src-supplier=RSComponents; ComponentLink2URL: https://datasheet.ciiva.com/11786/0900766b80c10176-11786120.pdf?src-supplier=RSComponents; ComponentLink3Description: https://datasheet.ciiva.com/7978/1489800-7978155.pdf?src-supplier=Element14; ComponentLink3URL: https://datasheet.ciiva.com/7978/1489800-7978155.pdf?src-supplier=Element14; ComponentLink4Description: https://datasheet.ciiva.com/28450/1489800-28450584.pdf?src-supplier=Element14; ComponentLink4URL: https://datasheet.ciiva.com/28450/1489800-28450584.pdf?src-supplier=Element14; ComponentLink5Description: https://datasheet.ciiva.com/144/mlccorderingcode-144074.pdf?src-supplier=Digi-Key; ComponentLink5URL: https://datasheet.ciiva.com/144/mlccorderingcode-144074.pdf?src-supplier=Digi-Key; ComponentLink6Description: https://datasheet.ciiva.com/144/mlccorderingcode-144073.pdf?src-supplier=Digi-Key; ComponentLink6URL: https://datasheet.ciiva.com/144/mlccorderingcode-144073.pdf?src-supplier=Digi-Key; ComponentLink7Description: https://datasheet.ciiva.com/13389/upy-gphc-x7r-6-3v-to-50v-8-13389352.pdf?src-supplier=Mouser; ComponentLink7URL: https://datasheet.ciiva.com/13389/upy-gphc-x7r-6-3v-to-50v-8-13389352.pdf?src-supplier=Mouser; ComponentLink8Description: https://datasheet.ciiva.com/11587/upy-gphc-x7r-6-3v-to-50v-8-11587208.pdf?src-supplier=Avnet; ComponentLink8URL: https://datasheet.ciiva.com/11587/upy-gphc-x7r-6-3v-to-50v-8-11587208.pdf?src-supplier=Avnet; ComponentLink9Description: https://datasheet.ciiva.com/26829/getdatasheetpartid-403577-26829431.pdf?src-supplier=Verical; ComponentLink9URL: https://datasheet.ciiva.com/26829/getdatasheetpartid-403577-26829431.pdf?src-supplier=Verical; ComponentLink10Description: https://datasheet.ciiva.com/17434/upy-gphc-x7r-6-3v-to-50v-8-17434263.pdf?src-supplier=Avnet+Europe; ComponentLink10URL: https://datasheet.ciiva.com/17434/upy-gphc-x7r-6-3v-to-50v-8-17434263.pdf?src-supplier=Avnet+Europe
C75 C79 C80 = CMP-001-00096-2: as C16 on sheet EEPROM; Case/Package: 0603; Pins: 2; Min Operating Temperature: -55°C; Max Operating Temperature: 125°C; Design Item ID: 06035C103KAT2A; Case Code (Metric): 1608; Category: Ceramic Capacitors; Contact Plating: Tin,Matte; Depth: 0.81mm; Dielectric: X7R; Dielectric Material: Ceramic; Height: 0.9mm; Lead Free: Lead Free; Length: 1.6mm; Manufacturer Part Number: 06035C103KAT2A; Mount: Surface Mount,PCB; Packaging: Tape and Reel; Radiation Hardening: No; REACH SVHC: No SVHC; RoHS: Yes; Stock 1: 4334081; Termination: SMD/SMT; Thickness: 0.035inch; Voltage: 50V; Voltage Rating (DC): 50V; Width: 0.032inch; ComponentLink1Description: https://datasheet.ciiva.com/2987/cx7r-2987824.pdf?src-supplier=Avnet; ComponentLink1URL: https://datasheet.ciiva.com/2987/cx7r-2987824.pdf?src-supplier=Avnet; ComponentLink2Description: https://datasheet.ciiva.com/1124/1679506-1124848.pdf?src-supplier=Element14; ComponentLink2URL: https://datasheet.ciiva.com/1124/1679506-1124848.pdf?src-supplier=Element14; ComponentLink3Description: https://datasheet.ciiva.com/7855/1679506-7855082.pdf?src-supplier=Element14; ComponentLink3URL: https://datasheet.ciiva.com/7855/1679506-7855082.pdf?src-supplier=Element14; ComponentLink4Description: https://datasheet.ciiva.com/150/cx7r-150227.pdf?src-supplier=Digi-Key; ComponentLink4URL: https://datasheet.ciiva.com/150/cx7r-150227.pdf?src-supplier=Digi-Key; ComponentLink5Description: https://datasheet.ciiva.com/150/cx7r-150229.pdf?src-supplier=Digi-Key; ComponentLink5URL: https://datasheet.ciiva.com/150/cx7r-150229.pdf?src-supplier=Digi-Key
C76 = CMP-001-00180-2: as C18 on sheet EEPROM; Manufacturer Part Number: C0805C106K9PACTU; Mount: Surface Mount; Case/Package: 0805; Case Code (Metric): 2012; Dielectric Material: Ceramic; Contact Material: Tin; Min Operating Temperature: -55°C; Max Operating Temperature: 85°C; Tolerance: 10%; Voltage Rating (DC): 6.3V; Dielectric: X5R; Packaging: Tape and Reel; Voltage Rating: 6.3V; Series: SMD Comm X5R; Construction: Flat; Length: 2mm; Width: 1.2mm; Height: 1.25mm; Depth: 1.25mm; Lead Pitch: 0.75mm; Radiation Hardening: No; RoHS Compliant: Yes; Lead Free: Lead Free; Reach SVHC Compliant: No; ComponentLink1URL: https://datasheet.ciiva.com/7842/kem-c1006-x5r-smd-7842200.pdf?src-supplier=Element14; ComponentLink1Description: https://datasheet.ciiva.com/7842/kem-c1006-x5r-smd-7842200.pdf?src-supplier=Element14; ComponentLink2URL: https://datasheet.ciiva.com/7842/kem-c1006-x5r-smd-7842201.pdf?src-supplier=Element14; ComponentLink2Description: https://datasheet.ciiva.com/7842/kem-c1006-x5r-smd-7842201.pdf?src-supplier=Element14; ComponentLink3URL: https://datasheet.ciiva.com/7842/40889-7842553.pdf?src-supplier=Element14; ComponentLink3Description: https://datasheet.ciiva.com/7842/40889-7842553.pdf?src-supplier=Element14; ComponentLink4URL: https://datasheet.ciiva.com/7842/40889-7842554.pdf?src-supplier=Element14; ComponentLink4Description: https://datasheet.ciiva.com/7842/40889-7842554.pdf?src-supplier=Element14; ComponentLink5URL: https://datasheet.ciiva.com/18193/getdatasheetpartid-320652-18193500.pdf?src-supplier=Verical; ComponentLink5Description: https://datasheet.ciiva.com/18193/getdatasheetpartid-320652-18193500.pdf?src-supplier=Verical; Pins: 2; Mounting Technology: SMD/SMT
C77 C78 = CMP-001-00183-1: CAP CER 20PF 50V NPO 0805; Manufacturer: Yageo; Tolerance: 5%; Dielectric: NP0; Manufacturer Part Number: CC0805JRNPO9BN200; RoHS: Yes; Category: Ceramic Capacitors; Stock: 3029; Pricing: 1=0.13, 10=0.054, 50=0.054, 100=0.032, 1000=0.026, 10000=0.017 (USD); Mounting Technology: Surface Mount; Case/Package: 0805; Pins: 2; Case Code (Metric): 2012; Min Operating Temperature: -55°C; Max Operating Temperature: 125°C; Voltage Rating: 50V; Packaging: Tape and Reel; Voltage Rating (DC): 50V; Termination: SMD/SMT; Series: CC; Length: 0.079inch; Width: 1.25mm; Thickness: 0.028inch; Lead Free: Lead Free; ComponentLink1URL: https://datasheet.ciiva.com/5427/upy-gp-np0-16v-to-50v-8-5427416.pdf?src-supplier=Mouser; ComponentLink1Description: https://datasheet.ciiva.com/5427/upy-gp-np0-16v-to-50v-8-5427416.pdf?src-supplier=Mouser; Design Item ID: CC0805JRNPO9BN200; Component Type: Standard; Pin Count: 2; Source: V4-TEL.SCHLIB
FB4 = CMP-006-00051-1: as FB2 on sheet EEPROM; RoHS: Yes; Category: Ferrite Beads and Chips; Case/Package: 0603; Min Operating Temperature: -55°C; Max Operating Temperature: 125°C; Package Quantity: 1000; Packaging: Bulk; ComponentLink1URL: http://www.mouser.com/ds/2/281/c31e-794748.pdf?src-supplier=Mouser; ComponentLink1Description: http://www.mouser.com/ds/2/281/c31e-794748.pdf?src-supplier=Mouser; Pins: 2; Design Item ID: BLM18PG471SN1B; Source: PTZLib.SchLib
Q14 = CMP-012-00003-2: MMBT2222 Series NPN 350 mW 40 V 600 mA SMT Small Signal Transistor - SOT-23; Manufacturer: Diodes; Current Rating: 600mA; Voltage Rating: 40V; Collector Base Voltage (VCBO): 75V; Collector Emitter Saturation Voltage: 1V; Current: 1A; Element Configuration: Single; Emitter Base Voltage (VEBO): 6V; Frequency: 300MHz; hFE Min: 100; Max Power Dissipation: 300mW; Number of Elements: 1; Power Dissipation: 350mW; Case/Package: SOT-23-3; Pins: 3; RoHS Compliant: Yes; Min Operating Temperature: -55°C; Max Operating Temperature: 150°C; Design Item ID: MMBT2222A-7-F; Category: BJTs; Collector Emitter Breakdown Voltage: 40V; Collector Emitter Voltage (VCEO): 40V; Collector-emitter Voltage-Max: 1V; Component Type: Standard; Contact Plating: Tin,Matte; Continuous Collector Current: 600mA; Gain Bandwidth Product: 300MHz; Height: 1mm; Lead Free: Lead Free; Length: 3.05mm; Manufacturer Part Number: MMBT2222A-7-F; Max Collector Current: 600mA; Max Frequency: 300MHz; Mount: Surface Mount; Package Quantity: 3000; Packaging: Tape and Reel; Pin Count: 3; Polarity: NPN; Pricing 1: 1=0.14000, 10=0.13300, 50=0.13300, 100=0.07200, 500=0.04500, 1000=0.03100, 3000=0.02300, 9000=0.02000, 10000=0.02000, 24000=0.01800, 45000=0.01500 (USD); Radiation Hardening: No; Reach SVHC Compliant: Yes; RoHS: Yes; Series: Automotive, AEC-Q101; Source: PTZ.SCHLIB; Stock 1: 1743698; Termination: SMD/SMT; Transition Frequency: 300MHz; Voltage: 40V; Voltage Rating (DC): 40V; Weight: 0.000282oz; Width: 1.4mm; ComponentLink1Description: https://datasheet.ciiva.com/15139/getdatasheetpartid-82692-15139078.pdf?src-supplier=Verical; ComponentLink1URL: https://datasheet.ciiva.com/15139/getdatasheetpartid-82692-15139078.pdf?src-supplier=Verical; ComponentLink2Description: https://datasheet.ciiva.com/8029/ds30041-8029709.pdf?src-supplier=Element14; ComponentLink2URL: https://datasheet.ciiva.com/8029/ds30041-8029709.pdf?src-supplier=Element14; ComponentLink3Description: https://datasheet.ciiva.com/11201/ds30041-11201864.pdf?src-supplier=Avnet; ComponentLink3URL: https://datasheet.ciiva.com/11201/ds30041-11201864.pdf?src-supplier=Avnet; ComponentLink4Description: https://datasheet.ciiva.com/16199/ds30041-16199045.pdf?src-supplier=Future+Electronics; ComponentLink4URL: https://datasheet.ciiva.com/16199/ds30041-16199045.pdf?src-supplier=Future+Electronics; ComponentLink5Description: https://datasheet.ciiva.com/11198/ds30041-11198965.pdf?src-supplier=Avnet; ComponentLink5URL: https://datasheet.ciiva.com/11198/ds30041-11198965.pdf?src-supplier=Avnet; ComponentLink6Description: https://datasheet.ciiva.com/972/ds30041-972551.pdf?src-supplier=Digi-Key; ComponentLink6URL: https://datasheet.ciiva.com/972/ds30041-972551.pdf?src-supplier=Digi-Key; ComponentLink7Description: https://datasheet.ciiva.com/972/ds30041-972552.pdf?src-supplier=Digi-Key; ComponentLink7URL: https://datasheet.ciiva.com/972/ds30041-972552.pdf?src-supplier=Digi-Key; ComponentLink8Description: https://datasheet.ciiva.com/972/ds30041-972550.pdf?src-supplier=Digi-Key; ComponentLink8URL: https://datasheet.ciiva.com/972/ds30041-972550.pdf?src-supplier=Digi-Key
R104 R105 = CMP-009-00307-1: Res Thick Film 0805 200K Ohm 1% 1/8W ±100ppm/°C Molded SMD Paper T/R; Manufacturer: Yageo; Manufacturer Part Number: RC0805FR-07200KL; Power Rating: 125mW; Voltage Rating: 150V; RoHS: Yes; Category: Chip SMD Resistors; Stock 1: 312674; Pricing 1: 1=0.1, 10=0.033, 50=0.033, 100=0.014, 1000=0.006, 10000=0.003 (USD); Case/Package: 0805; Case Code (Metric): 2012; Contact Plating: Tin,Matte; Min Operating Temperature: -55°C; Max Operating Temperature: 155°C; Tolerance: 1%; Packaging: Tape and Reel; Termination: SMD/SMT; Resistor Type: Thick Film; Temperature Coefficient: 100ppm/°C; Voltage Rating (DC): 150V; Working Voltage: 150V; Number of Terminations: 2; Features: Moisture Resistant; Series: RC; Max Power Dissipation: 125mW; Resistance Tolerance: 1%; Technology: THICK FILM; Construction: Rectangular; Length: 2mm; Height: 0.5mm; Depth: 1.25mm; Reach SVHC Compliant: No; Military Standard: Not; Lead Free: Lead Free; RoHS Compliant: Yes; ComponentLink1URL: https://datasheet.ciiva.com/46395/444164-46395126.pdf?src-supplier=Element14; ComponentLink1Description: https://datasheet.ciiva.com/46395/444164-46395126.pdf?src-supplier=Element14; ComponentLink2URL: https://datasheet.ciiva.com/12668/rc0805-12668200.pdf?src-supplier=Mouser; ComponentLink2Description: https://datasheet.ciiva.com/12668/rc0805-12668200.pdf?src-supplier=Mouser; ComponentLink3URL: https://datasheet.ciiva.com/15189/getdatasheetpartid-71710-15189925.pdf?src-supplier=Verical; ComponentLink3Description: https://datasheet.ciiva.com/15189/getdatasheetpartid-71710-15189925.pdf?src-supplier=Verical; Pins: 2; Design Item ID: RC0805FR-07200KL; Component Type: Standard; Pin Count: 2; Source: V4-TEL.SCHLIB
R106-R108 = CMP-009-00190-2: RES SMD 4.7K OHM 5% 1/10W 0603; Manufacturer 1: Rohm; Max Power Dissipation: 100mW; Temperature Coefficient: 200ppm/°C; Case/Package: 0603; RoHS Compliant: Yes; Min Operating Temperature: -55°C; Max Operating Temperature: 155°C; Tolerance: 5%; Design Item ID: KTR03EZPJ472; Category: Chip SMD Resistors; Height: 0.022inch; Length: 0.063inch; Manufacturer Part Number 1: KTR03EZPJ472; Number of Terminations: 2; Package Quantity: 5000; Packaging: Tape and Reel; Pricing 1: 1=0.13000, 10=0.11500, 50=0.11500, 100=0.04400, 1000=0.02200, 10000=0.01400 (USD); Resistor Type: Thick Film; RoHS: Yes; Series: KTR03; Source: PTZLib.SchLib; Stock 1: 12843; Width: 0.031inch; ComponentLink1Description: https://datasheet.ciiva.com/14984/ktr-14984741.pdf?src-supplier=Digi-Key; ComponentLink1URL: https://datasheet.ciiva.com/14984/ktr-14984741.pdf?src-supplier=Digi-Key
R109 = CMP-009-00314-1: High Precision-High Stability Chip Resistor Thin Film 0805 47kOhm 1% Paper T/R; Manufacturer: Yageo; Manufacturer Part Number: RT0805FRE0747KL; Power Rating: 125mW; Voltage Rating: 150V; Temperature Coefficient: 50ppm/°C; RoHS: Yes; Category: Chip SMD Resistors; Stock 1: 83330; Pricing 1: 1=0.1, 10=0.081, 50=0.081, 100=0.031, 1000=0.014, 10000=0.009 (USD); Case/Package: 0805; Case Code (Metric): 2012; Min Operating Temperature: -55°C; Max Operating Temperature: 125°C; Tolerance: 1%; Packaging: Tape and Reel; Resistor Type: Thin Film; Termination: SMD/SMT; Number of Terminations: 2; Max Power Dissipation: 125mW; Voltage Rating (DC): 150V; Features: Moisture Resistant; Series: RT; Resistance Tolerance: 1%; Length: 0.079inch; Width: 0.049inch; Height: 0.024inch; Reach SVHC Compliant: No; Lead Free: Lead Free; RoHS Compliant: Yes; ComponentLink1URL: https://datasheet.ciiva.com/7942/1392914-7942152.pdf?src-supplier=Element14; ComponentLink1Description: https://datasheet.ciiva.com/7942/1392914-7942152.pdf?src-supplier=Element14; ComponentLink2URL: https://datasheet.ciiva.com/7942/1392914-7942153.pdf?src-supplier=Element14; ComponentLink2Description: https://datasheet.ciiva.com/7942/1392914-7942153.pdf?src-supplier=Element14; ComponentLink3URL: https://datasheet.ciiva.com/5990/1392914-5990606.pdf?src-supplier=Farnell; ComponentLink3Description: https://datasheet.ciiva.com/5990/1392914-5990606.pdf?src-supplier=Farnell; Pins: 2; Design Item ID: RT0805FRE0747KL; Component Type: Standard; Pin Count: 2; Source: V4-TEL.SCHLIB
U12 = CMP-076-000005-3: SOP-8 Telecommunication Interface ICs ROHS; Component Type: Standard; RoHS Compliant: No; Mounting Technology: SMT; Pins: 8
X1 = CMP-003-00038-1: Crystal 3.579545MHz ±30ppm (Tol) ±50ppm (Stability) 18pF FUND 180Ohm 2-Pin HC-49/US SMD T/R; Manufacturer: Abracon; ESR (Equivalent Series Resistance): 180; Manufacturer Part Number: ABLS-3.579545MHZ-B4-T; RoHS: Yes; Category: Crystals; Stock: 4835; Pricing: 1=0.17, 10=0.138, 50=0.138, 100=0.138, 1000=0.132, 10000=0.108 (USD); Mounting Technology: Surface Mount; Case/Package: SMD/SMT; Min Operating Temperature: -20°C; Max Operating Temperature: 70°C; Packaging: Tape and Reel; Frequency Tolerance: 30ppm; Load Capacitance: 18pF; Package Quantity: 1000; Tolerance: 30ppm; Frequency Stability: 50ppm; Termination: SMD/SMT; ESR: 180; Series: ABLS; Length: 11.4mm; Width: 4.7mm; Height: 4.2mm; Depth: 4.7mm; Radiation Hardening: No; Lead Free: Lead Free; ComponentLink1URL: https://datasheet.ciiva.com/15116/getdatasheetpartid-719920-15116797.pdf?src-supplier=Verical; ComponentLink1Description: https://datasheet.ciiva.com/15116/getdatasheetpartid-719920-15116797.pdf?src-supplier=Verical; ComponentLink2URL: https://datasheet.ciiva.com/854/abls-854168.pdf?src-supplier=Digi-Key; ComponentLink2Description: https://datasheet.ciiva.com/854/abls-854168.pdf?src-supplier=Digi-Key; ComponentLink3URL: https://datasheet.ciiva.com/854/abls-854169.pdf?src-supplier=Digi-Key; ComponentLink3Description: https://datasheet.ciiva.com/854/abls-854169.pdf?src-supplier=Digi-Key; ComponentLink4URL: https://datasheet.ciiva.com/854/abls-854170.pdf?src-supplier=Digi-Key; ComponentLink4Description: https://datasheet.ciiva.com/854/abls-854170.pdf?src-supplier=Digi-Key; ComponentLink5URL: https://datasheet.ciiva.com/4944/abls-44621-4944684.pdf?src-supplier=Mouser; ComponentLink5Description: https://datasheet.ciiva.com/4944/abls-44621-4944684.pdf?src-supplier=Mouser; Pins: 2; Design Item ID: ABLS-3.579545MHZ-B4-T; Component Type: Standard; Source: V4-TEL.SCHLIB